# Altium schematic sheet RS232.SchDoc
size A4
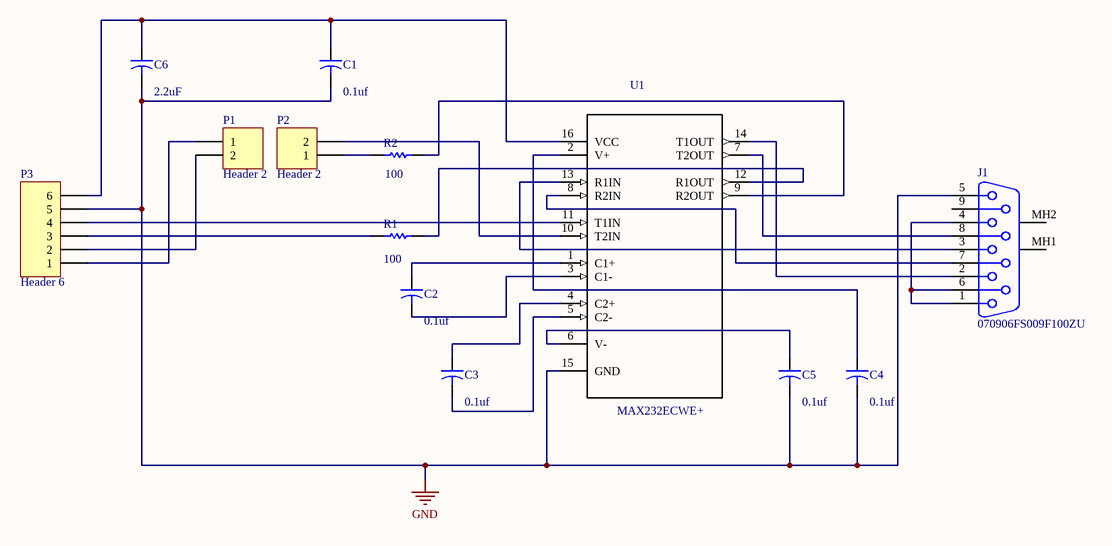
[diagram p0: RS232.SchDoc]

## Parts
C1  value 0.1uf  [CAPR5-4X5]  (hidden comment: Cap2)
C2  value 0.1uf  [CAPR5-4X5]
C3  value 0.1uf  [CAPR5-4X5]
C4  value 0.1uf  [CAPR5-4X5]
C5  value 0.1uf  [CAPR5-4X5]
C6  Cap2  [CAPR5-4X5]  (value not drawn)
J1  070906FS009F100ZU  [070906FS009]
P1  Header 2  [HDR1X2]
P2  Header 2  [HDR1X2]
P3  Header 6  [HDR1X6]
R1  value 100  [AXIAL-0.3]  (hidden comment: Res1)
R2  value 100  [AXIAL-0.3]
U1  MAX232ECWE+  [SOIC127P1032X265-16N]

## Nets
GND: C1.2 C4.2 C5.2 C6.2 J1.5 P3.5 U1.15(GND)
NetC1_1: C1.1 C6.1 P3.6 U1.16(VCC)
NetC2_1: C2.1 U1.1(C1+)
NetC2_2: C2.2 U1.3(C1-)
NetC3_1: C3.1 U1.4(C2+)
NetC3_2: C3.2 U1.5(C2-)
NetC4_1: C4.1 U1.2(V+)
NetC5_1: C5.1 U1.6(V-)
NetJ1_1: J1.1 J1.4 J1.6
NetJ1_2: J1.2 U1.14(T1OUT)
NetJ1_3: J1.3 U1.13(R1IN)
NetJ1_7: J1.7 U1.8(R2IN)
NetJ1_8: J1.8 U1.7(T2OUT)
NetP1_1: P1.1 P3.1
NetP1_2: P1.2 P3.2
NetP2_1: P2.1 R2.1
NetP2_2: P2.2 U1.10(T2IN)
NetP3_3: P3.3 R1.1
NetP3_4: P3.4 U1.11(T1IN)
NetR1_2: R1.2 U1.12(R1OUT)
NetR2_2: R2.2 U1.9(R2OUT)

Not connected (* = marked no-connect by the designer): J1 9 MH1 MH2

## Notes on the sheet
- (in symbol Cap2) 2.2uF

## Library data of the parts
C1-C6 = Cap2: Capacitor; Published: 23-Sep-2002; PackageReference: CAPR5-4X5; Publisher: Altium Limited; PackageDescription: Capacitor; 2 Leads
J1 = 070906FS009F100ZU: Ultra Thin D-Sub, Straight Dip Type, Female Connector, THT, 9 Position, 2.2mm Pin Length; PCB_Layout: Complies with manufacturer's recommendation.; DrillSize: Corresponds to nominal value.; Published: 26-Sep-2008; DatasheetVersion: May-2003; PackageVersion: revK, Nov-2007; PackageReference: 070906FS009; Publisher: Altium Limited; PackageDescription: Connector; D-Sub, Thru-Hole; 9 Position; Vertical; Body 30.81 x 9.60 x 8.20 mm (LxWxH); ComponentLink1Description: Manufacturer Link; ComponentLink1URL: http://www.suyin.com/; ComponentLink2Description: Datasheet; ComponentLink2URL: http://www.suyin.at/pdf/i_o/d_sub/female/straight/070906FS.pdf
P1 P2 = Header 2: Header, 2-Pin; LatestRevisionDate: 17-Jul-2002; LatestRevisionNote: Re-released for DXP Platform.; Publisher: Altium Limited
P3 = Header 6: Header, 6-Pin; LatestRevisionDate: 17-Jul-2002; LatestRevisionNote: Re-released for DXP Platform.; Publisher: Altium Limited
R1 R2 = Res1: Resistor; Published: 8-Jun-2000; LatestRevisionDate: 17-Jul-2002; LatestRevisionNote: Re-released for DXP Platform.; PackageReference: AXIAL-0.3; Publisher: Altium Limited; PackageDescription: Axial Device, Thru-Hole; 2 Leads; 0.3 in Pin Spacing
U1 = MAX232ECWE+: Dual Transmitter/Receiver RS-232 16-Pin SOIC W; MF: Maxim Integrated; Package: SOIC-16 Maxim Integrated; Digi-Key_Purchase_URL: https://www.digikey.com.tr/product-detail/en/maxim-integrated/MAX232ECWE-/MAX232ECWE--ND/947838?utm_source=snapeda&utm_medium=aggregator&utm_campaign=symbol; Digi-Key_Part_Number: MAX232ECWE+-ND; SnapEDA_Link: https://www.snapeda.com/parts/MAX232ECWE%2B/Maxim%20Integrated/view-part/?ref=snap; MP: MAX232ECWE+; Value: *